# EAGLE design MainBoard (EAGLE 6.4)
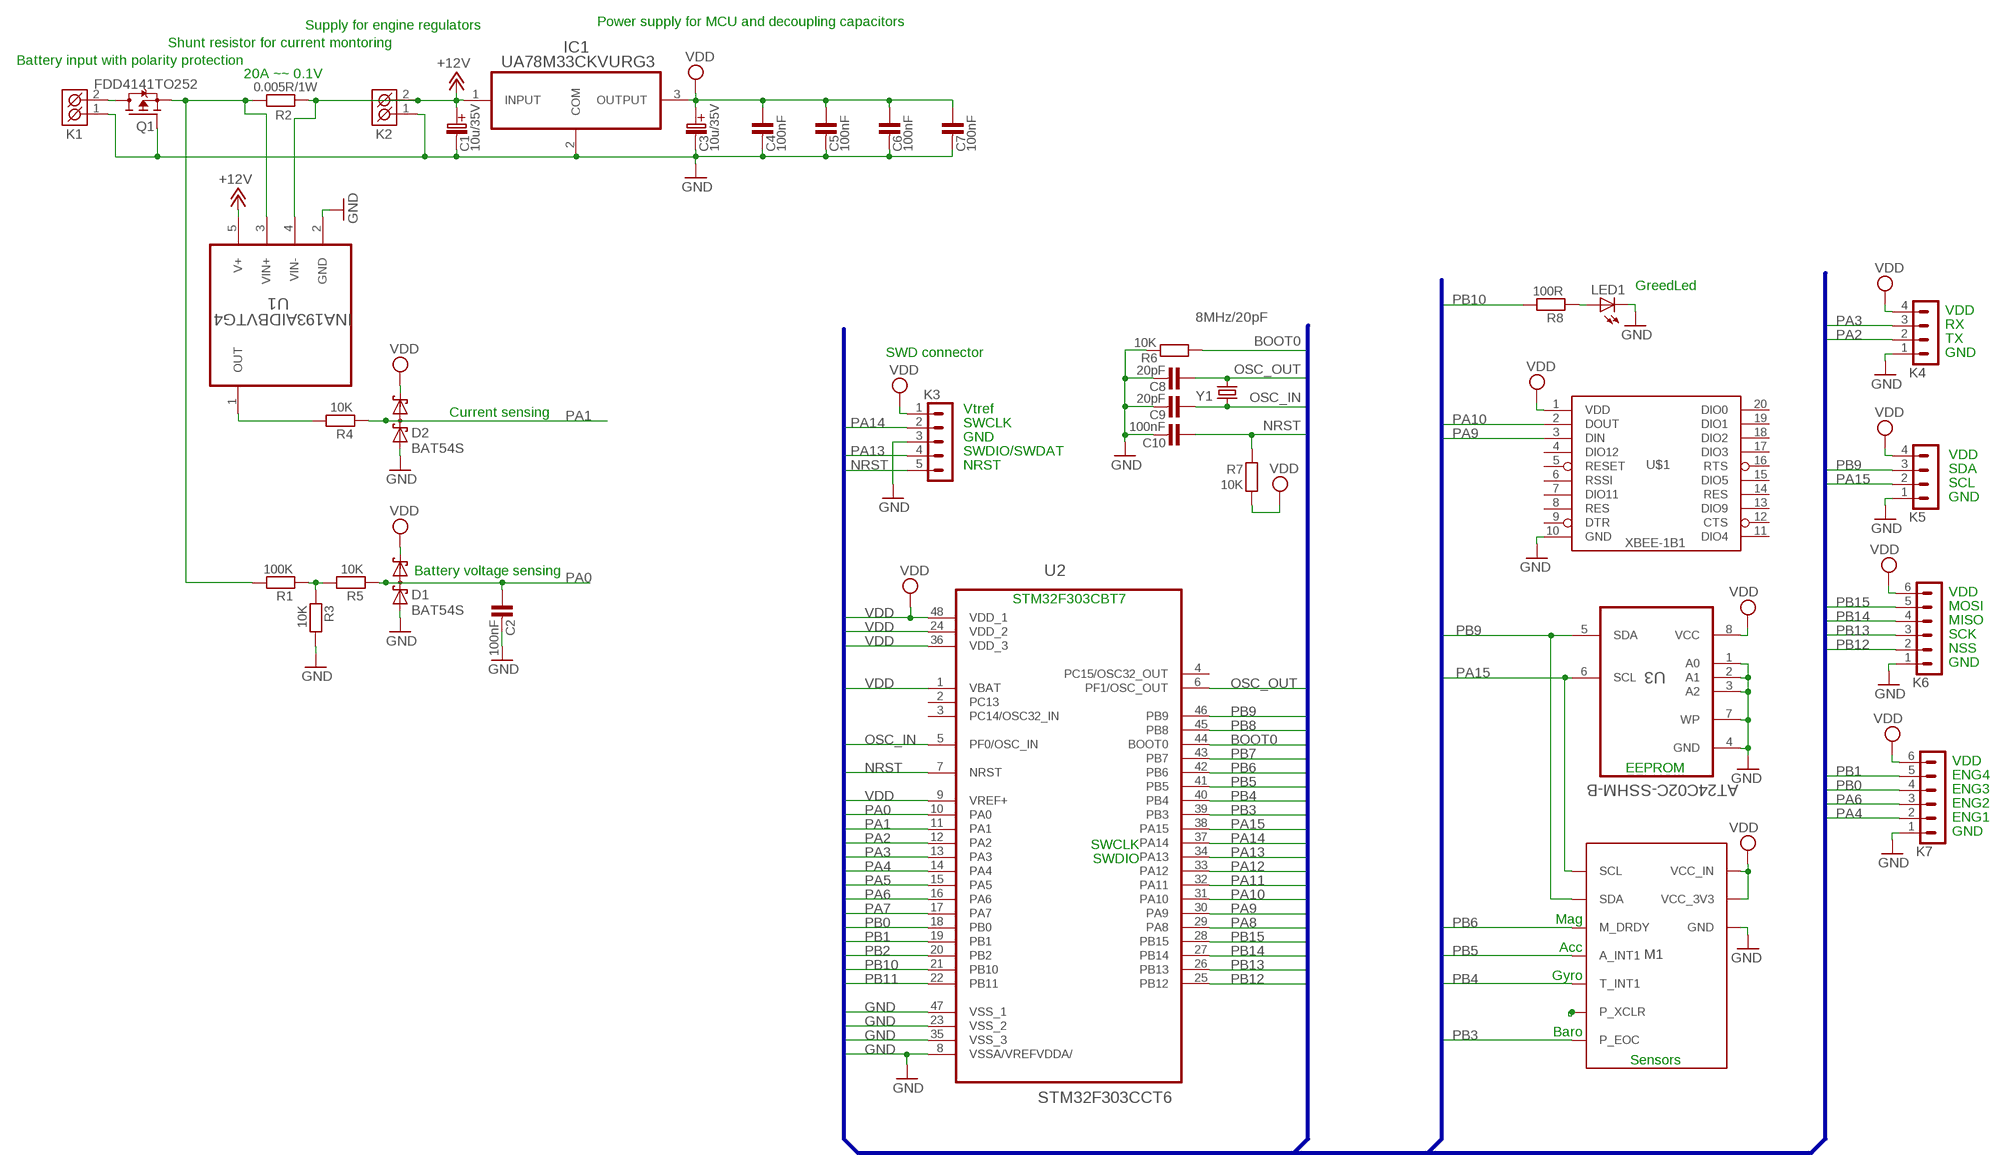
[diagram p0: schematic, sheet 1]

## Parts
C1  10u/35V  C-ELEKTROLYT_2,5  [C-EL_2,5]
C2  100nF  C-KERAMIK_SMD_1206  [1206]
C3  10u/35V  C-ELEKTROLYT_2,5  [C-EL_2,5]
C4  100nF  C-KERAMIK_SMD_1206  [1206]
C5  100nF  C-KERAMIK_SMD_1206  [1206]
C6  100nF  C-KERAMIK_SMD_1206  [1206]
C7  100nF  C-KERAMIK_SMD_1206  [1206]
C8  20pF  C-KERAMIK_SMD_1206  [1206]
C9  20pF  C-KERAMIK_SMD_1206  [1206]
C10  100nF  C-KERAMIK_SMD_1206  [1206]
D1  BAT54S  [SOT23]
D2  BAT54S  [SOT23]
IC1  UA78M33CKVURG3  [TO285P991X230-3N]
K1  ARK500/2  [ARK500/2]
K2  ARK500/2  [ARK500/2]
K3  PSH02-05P  [PSH02-05P]
K4  PSH02-04P  [PSH02-04P]
K5  PSH02-04P  [PSH02-04P]
K6  PSH02-06P  [PSH02-06P]
K7  PSH02-06P  [PSH02-06P]
LED1  LED_E  [LED_1206]
M1  GY-80_DEV  [GY-80_PAC]
Q1  FDD4141TO252  [TO252]
R1  100K  R_SMD_1206  [1206]
R2  0.005R/1W  R_12,7  [R-12,7]
R3  10K  R_SMD_1206  [1206]
R4  10K  R_SMD_1206  [1206]
R5  10K  R_SMD_1206  [1206]
R6  10K  R_SMD_1206  [1206]
R7  10K  R_SMD_1206  [1206]
R8  100R  R_SMD_1206  [1206]
U1  INA193AIDBVTG4  [SOT95P280X145-5N]
U2  STM32F303CCT6  [QFP50P900X900X160-48N]
U3  AT24C02C-SSHM-B  [SOIC127P600X175-8N]
U$1  XBEE-1B1  [XBEE-1]
Y1  8MHz/20pF  CRYSTALSMD  [HC49UP]

## Nets
+12V: C1.C+(C_EL+) IC1.1(INPUT) K2.2(K2) R2.1 U1.4(VIN-) U1.5(V+)
BOOT0: R6.2 U2.44(BOOT0)
GND: C1.C-(C_EL-) C2.2 C3.C-(C_EL-) C4.2 C5.2 C6.2 C7.2 C8.2 C9.2 C10.2 D1.1(A1) D2.1(A1) IC1.2(COM) K1.1(K1) K2.1(K1) K3.3 K4.1 K5.1 K6.1 K7.1 LED1.C M1.GND Q1.1(G) R3.2 R6.1 U1.2(GND) U2.8(VSSA/VREFVDDA/) U2.23(VSS_2) U2.35(VSS_3) U2.47(VSS_1) U3.1(A0) U3.2(A1) U3.3(A2) U3.4(GND) U3.7(WP) U$1.10(GND)
N$1: R4.2 U1.1(OUT)
N$2: M1.P_XCLR
N$3: Q1.2(S) R1.2 R2.2 U1.3(VIN+)
N$4: K1.2(K2) Q1.3(D)
N$9: R1.1 R3.1 R5.2
N$18: LED1.A R8.1
NRST: C10.1 K3.5 R7.2 U2.7(NRST)
OSC_IN: C9.1 U2.5(PF0/OSC_IN) Y1.1
OSC_OUT: C8.1 U2.6(PF1/OSC_OUT) Y1.2
PA0: C2.1 D1.3(C1A2) R5.1 U2.10(PA0)
PA1: D2.3(C1A2) R4.1 U2.11(PA1)
PA2: K4.2 U2.12(PA2)
PA3: K4.3 U2.13(PA3)
PA4: K7.2 U2.14(PA4)
PA5: U2.15(PA5)
PA6: K7.3 U2.16(PA6)
PA7: U2.17(PA7)
PA8: U2.29(PA8)
PA9: U2.30(PA9) U$1.3(DIN)
PA10: U2.31(PA10) U$1.2(DOUT)
PA11: U2.32(PA11)
PA12: U2.33(PA12)
PA13: K3.4 U2.34(PA13)
PA14: K3.2 U2.37(PA14)
PA15: K5.2 M1.SCL U2.38(PA15) U3.6(SCL)
PB0: K7.4 U2.18(PB0)
PB1: K7.5 U2.19(PB1)
PB2: U2.20(PB2)
PB3: M1.P_EOC U2.39(PB3)
PB4: M1.T_INT1 U2.40(PB4)
PB5: M1.A_INT1 U2.41(PB5)
PB6: M1.M_DRDY U2.42(PB6)
PB7: U2.43(PB7)
PB8: U2.45(PB8)
PB9: K5.3 M1.SDA U2.46(PB9) U3.5(SDA)
PB10: R8.2 U2.21(PB10)
PB11: U2.22(PB11)
PB12: K6.2 U2.25(PB12)
PB13: K6.3 U2.26(PB13)
PB14: K6.4 U2.27(PB14)
PB15: K6.5 U2.28(PB15)
VDD: C3.C+(C_EL+) C4.1 C5.1 C6.1 C7.1 D1.2(C2) D2.2(C2) IC1.3(OUTPUT) K3.1 K4.4 K5.4 K6.6 K7.6 M1.VCC_3V3 M1.VCC_IN R7.1 U2.1(VBAT) U2.9(VREF+) U2.24(VDD_2) U2.36(VDD_3) U2.48(VDD_1) U3.8(VCC) U$1.1(VDD)
Unconnected: U2.2(PC13) U2.3(PC14/OSC32_IN) U2.4(PC15/OSC32_OUT) U$1.4(DIO12) U$1.5(RESET) U$1.6(RSSI) U$1.7(DIO11) U$1.8(RES) U$1.9(DTR) U$1.11(DIO4) U$1.12(CTS) U$1.13(DIO9) U$1.14(RES) U$1.15(DIO5) U$1.16(RTS) U$1.17(DIO3) U$1.18(DIO2) U$1.19(DIO1) U$1.20(DIO0)

## Buses
BOOT0,NRST,OSC_IN,OSC_OUT,OSC32_IN,OSC32_OUT,VDD,VBAT,GND,VREF,PA[0..15],PB[0..15]

## Notes on the sheet
- Supply for engine regulators | Power supply for MCU and decoupling capacitors
- Shunt resistor for current montoring
- Battery input with polarity protection | 20A ~~ 0.1V
- GreedLed
- VDD
- RX
- TX
- SWD connector | GND
- Current sensing | Vtref
- SWCLK
- GND
- SWDIO/SWDAT | VDD
- NRST | SDA
- SCL
- GND
- Battery voltage sensing
- VDD
- STM32F303CBT7
- MOSI
- MISO
- SCK
- NSS
- GND
- VDD
- EEPROM
- ENG4
- ENG3
- ENG2
- ENG1
- SWCLK | GND
- SWDIO
- Mag
- Acc
- Gyro
- Baro
- Sensors

## Library data of the parts
C1 C3 = #PaJa_30:C-ELEKTROLYT: Kondenzator - elektrolyticky
C2 C4-C10 = #PaJa_30:C-KERAMIK: Kondenzator - keramicky
D1 D2 = diode:BAT54S: Schottky Diodes Pin connection corrected 2011-05-04 Source: Fairchild .. BAT54.pdf
IC1 = !moje_Sobriety:UA78M33CKVURG3: IC, POSITIVE-VOLTAGE REGULATORS, 3.3V, 3-TO-252; MPN: UA78M33CKVURG3; OC_FARNELL: 2075446; OC_NEWARK: 80K3502; PACKAGE: 3-TO-252; SUPPLIER: TEXAS INSTRUMENTS
K1 K2 = #PaJa_konektory:ARK500/2: Svorkovnice - roztec 5mm - dvojita
K3 = #PaJa_konektory:PSH02-05: Konektory se zamkem - vidlice - 5pin
K4 K5 = #PaJa_konektory:PSH02-04: Konektory se zamkem - vidlice - 4pin
K6 K7 = #PaJa_konektory:PSH02-06: Konektory se zamkem - vidlice - 6pin
LED1 = eagle-ltspice:LED_E: LED Source: http://www.osram.convergy.de Source: www.luxeon.com Source: www.kingbright.com; SPICEMODEL: NONE; SPICEPREFIX: D; SPICETYPE: diode
M1 = !moje_Sobriety:GY-80_DEV
Q1 = transistor-fet:FDD4141: P-Channel PowerTrench® MOSFET Source: FDD4141.pdf
R1-R8 = #PaJa_30:R: Rezistor
U1 = !moje_Sobriety:INA193AIDBVTG4: CURRENT SHUNT MONITOR -16V to +80V Common-Mode Range; MPN: INA193AIDBVTG4; OC_FARNELL: 1703229; OC_NEWARK: 37K0156; PACKAGE: SOT-23-5; SUPPLIER: Texas Instruments
U2 = !moje_Sobriety:STM32F303CCT6: MCU, 32BIT, CORTEX M4, 48LQFP; MPN: STM32F303CCT6; OC_FARNELL: 2215113; OC_NEWARK: 46W2192; PACKAGE: 48LQFP; SUPPLIER: STMicroelectronics
U3 = !moje_Sobriety:AT24C02C-SSHM-B: SERIAL EEPROM IC Memory Size:2Kbit,8-SOIC; MPN: AT24C02C-SSHM-B; OC_FARNELL: 1971995; OC_NEWARK: 68T4066; PACKAGE: 8SOIC; SUPPLIER: ATMEL
U$1 = SparkFun:XBEE-1
Y1 = SparkFun:CRYSTAL: Crystals Various standard crystals. Proven footprints. Spark Fun Electronics SKU : COM-00534

## Board
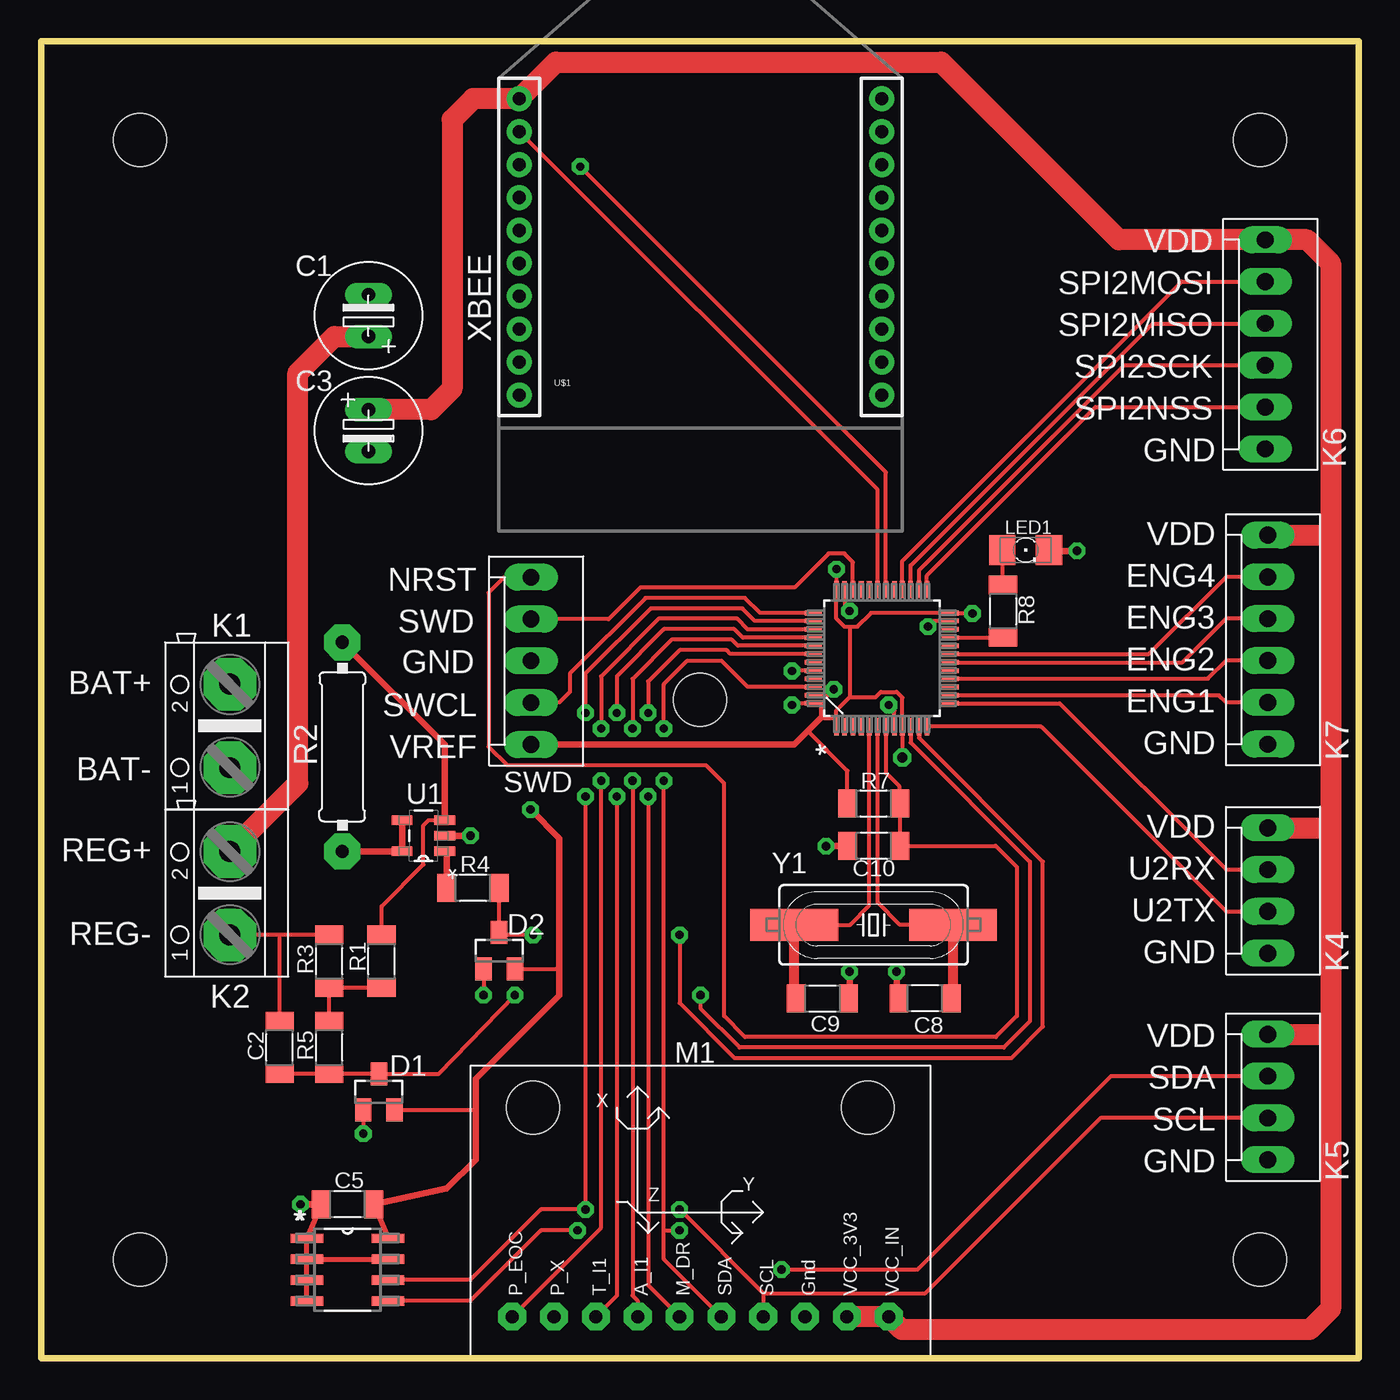
[diagram p1: board, top side]
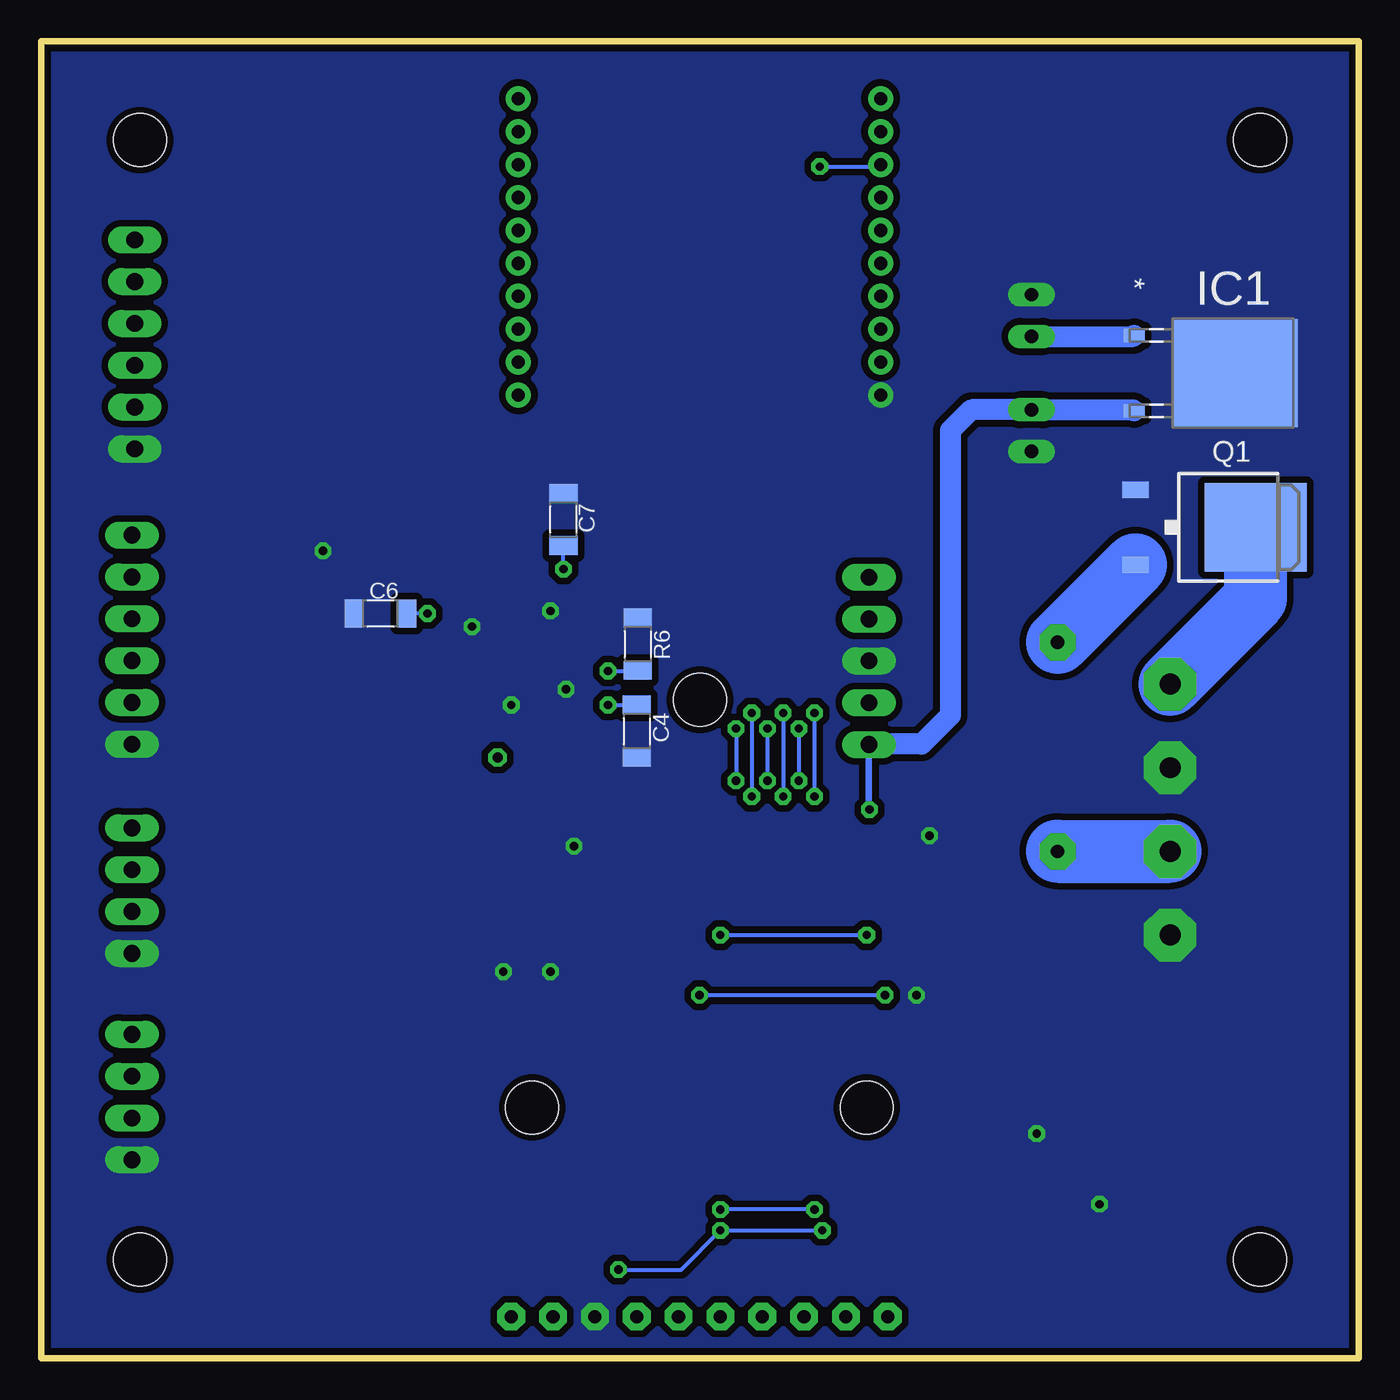
[diagram p2: board, bottom side, seen from below]

Size 80 x 80 mm. Coordinates in mm from the lower left corner, seen from the top.
Outline: 0,80 0,0 80,0 80,80 0,80
Copper layers (1*16): Top 0.035mm / dielectric 1.5mm / Bottom 0.035mm
Design rules "SparkFun": minimum track width 8mil, minimum drill 20mil, track to track 8mil, track to pad 8mil, pad to pad 8mil, via to via 8mil, smd to smd 8mil, copper to edge 10mil, drill to drill 8mil, minimum pad ring 12mil, minimum via ring 10mil, stop-mask expansion 4mil, vias tented up to drill 25mil, thermal gap 10mil
Holes 3.2 mm at 6,6 74,6 74,74 6,74 40,40

### Footprints (pad centres in the part's own frame; a part is rotated, then mirrored left to right if it is on the bottom)
C-EL_2,5 = drill 0.813 pad 1.27 long: C+ -1.27,0; C- 1.27,0
1206 = smd 1.143 x 1.702: 1 -1.587,0; 2 1.587,0
SOT23 = smd 1 x 1.4: 1 -0.95,-1.1; 2 0.95,-1.1; 3 0,1.1
TO285P991X230-3N = smd 0.813 x 1.27: 1 -2.286,-5.994; 3 2.286,-5.994 | smd 6.579 x 7.595: 2 0,0.152
ARK500/2 = drill 1.27 pad 3.2 octagon: 1 -2.54,0; 2 2.54,0
PSH02-05P = drill 1.016 pad 1.422 long: 1 -5.08,0; 2 -2.54,0; 3 0,0; 4 2.54,0; 5 5.08,0
PSH02-04P = drill 1.016 pad 1.422 long: 1 -3.81,0; 2 -1.27,0; 3 1.27,0; 4 3.81,0
PSH02-06P = drill 1.016 pad 1.422 long: 1 -6.35,0; 2 -3.81,0; 3 -1.27,0; 4 1.27,0; 5 3.81,0; 6 6.35,0
LED_1206 = smd 1.6 x 1.803: A -1.422,0; C 1.422,0
GY-80_PAC = drill 0.8 pad 1.676 octagon: A_INT1 -7.62,-5.08; GND 2.54,-5.08; M_DRDY -5.08,-5.08; P_EOC -15.24,-5.08; P_XCLR -12.7,-5.08; SCL 0,-5.08; SDA -2.54,-5.08; T_INT1 -10.16,-5.08; VCC_3V3 5.08,-5.08; VCC_IN 7.62,-5.08 | hole 3.2: -13.97,7.62; 6.35,7.62
TO252 = smd 1 x 1.6: 1 -2.28,-4.8; 2 2.28,-4.8 | smd 5.4 x 6.2: 3 0,2.5
R-12,7 = drill 0.813 pad 2.184 octagon: 1 -6.35,0; 2 6.35,0
SOT95P280X145-5N = smd 1.27 x 0.559: 1 -1.295,0.94; 2 -1.295,0; 3 -1.295,-0.94; 4 1.295,-0.94; 5 1.295,0.94
QFP50P900X900X160-48N = smd 1.041 x 0.279: 1 -4.166,2.743; 2 -4.166,2.261; 3 -4.166,1.753; 4 -4.166,1.245; 5 -4.166,0.762; 6 -4.166,0.254; 7 -4.166,-0.254; 8 -4.166,-0.762; 9 -4.166,-1.245; 10 -4.166,-1.753; 11 -4.166,-2.261; 12 -4.166,-2.743; 25 4.166,-2.743; 26 4.166,-2.261; 27 4.166,-1.753; 28 4.166,-1.245; 29 4.166,-0.762; 30 4.166,-0.254; 31 4.166,0.254; 32 4.166,0.762; 33 4.166,1.245; 34 4.166,1.753; 35 4.166,2.261; 36 4.166,2.743 | smd 0.279 x 1.041: 13 -2.743,-4.166; 14 -2.261,-4.166; 15 -1.753,-4.166; 16 -1.245,-4.166; 17 -0.762,-4.166; 18 -0.254,-4.166; 19 0.254,-4.166; 20 0.762,-4.166; 21 1.245,-4.166; 22 1.753,-4.166; 23 2.261,-4.166; 24 2.743,-4.166; 37 2.743,4.166; 38 2.261,4.166; 39 1.753,4.166; 40 1.245,4.166; 41 0.762,4.166; 42 0.254,4.166; 43 -0.254,4.166; 44 -0.762,4.166; 45 -1.245,4.166; 46 -1.753,4.166; 47 -2.261,4.166; 48 -2.743,4.166
SOIC127P600X175-8N = smd 1.981 x 0.559: 1 -2.464,1.905; 2 -2.464,0.635; 3 -2.464,-0.635; 4 -2.464,-1.905; 5 2.464,-1.905; 6 2.464,-0.635; 7 2.464,0.635; 8 2.464,1.905
XBEE-1 = drill 0.8 pad 1.524: 1 -11,20; 2 -11,18; 3 -11,16; 4 -11,14; 5 -11,12; 6 -11,10; 7 -11,8; 8 -11,6; 9 -11,4; 10 -11,2; 11 11,2; 12 11,4; 13 11,6; 14 11,8; 15 11,10; 16 11,12; 17 11,14; 18 11,16; 19 11,18; 20 11,20
HC49UP = smd 5.334 x 1.93: 1 -4.826,0; 2 4.826,0

### Placement (x,y rotation side)
C1  19.87,63.34 90 top
C2  14.47,18.89 90 top
C3  19.87,56.35 270 top
C4  43.84,38.09 270 bottom
C5  18.6,9.36 180 top
C6  59.4,45.24 180 bottom
C7  48.29,50.95 90 bottom
C8  53.67,21.87 180 top
C9  47.43,21.85 0 top
C10  50.56,31.12 180 top
D1  20.5,16.19 0 top
D2  27.81,24.76 0 top
IC1  7.65,59.84 270 bottom
K1  11.46,38.41 90 top
K2  11.46,28.25 90 top
K3  29.74,42.36 90 top
K4  74.48,28.41 90 top
K5  74.48,15.87 90 top
K6  74.32,61.59 90 top
K7  74.48,43.65 90 top
LED1  59.78,49.09 0 top
M1  43.84,7.61 0 top
Q1  8.76,50.48 270 bottom
R1  20.66,24.12 90 top
R2  18.28,37.14 90 top
R3  17.49,24.12 90 top
R4  26.22,28.57 180 top
R5  17.49,18.89 90 top
R6  43.78,43.38 270 bottom
R7  50.54,33.71 0 top
R8  58.4,45.38 270 top
U1  23.2,31.74 180 top
U2  51.04,42.53 90 top
U3  18.6,5.39 0 top
U$1  40.03,56.51 0 top
Y1  50.54,26.33 0 top

### Tracks (layer width: path | path; a pad name or v marks a point on that pad's centre or on a via)
+12V
  Top 0.406: U1.4 U1.5 21.9,30.79 R2.1
  Top 1.27: K2.2 15.58,34.92 15.58,59.84 17.81,62.06 C1.C+
  Bottom 1.27: C1.C+ 13.7,62.06 IC1.1
  Bottom 3.81: R2.1 K2.2
BOOT0  (via drill 0.5 pad 0.41)
  Top 0.254: U2.44 45.61,41.77 v45.59,41.74
  Bottom 0.254: v45.59,41.74 43.67,41.74 R6.2
GND  (via drill 0.5, 0.5 pad 0.41)
  Top 0.254: 51.81,38.37 U2.8 51.8,39.34 v51.46,39.68 | U2.35 48.79,46.68 48.79,45.68 v49.08,45.4 | U2.47 47.76,40.27 v48.13,40.63 | U2.23 54.19,44.79 v53.84,44.44 | D2.1 26.86,21.9 v26.86,22.06 | D1.1 v19.56,13.65 v19.55,13.65 | R3.2 14.47,25.71 | 14.47,25.71 K2.1 | C2.2 14.47,25.71
  Top 0.305: U3.4 U3.3 U3.2 | U3.2 U3.1 C5.2 | U3.2 U3.7
  Top 0.406: C5.2 v15.74,9.36 | C8.2 arc-90 51.94,22.01 v51.94,23.49 | C9.2 arc90 49.08,21.92 v49.08,23.49 | C10.2 arc-90 48.95,31.11 v47.65,31.11 | LED1.C 61.25,49.05 v62.89,49.05 | U1.2 v26.06,31.74
  Bottom 0.254: v26.86,22.06 26.86,21.74 | v19.55,13.65 19.55,13.33
  Bottom 0.406: v51.94,23.49 51.94,23.65 | v49.08,23.49 49.08,23.65 | v62.89,49.05 63.05,49.05 | v26.06,31.74 25.9,31.74
  pour Bottom (isolate 0.406, no thermals): 0.03,80 80.04,80 80.04,-0.01 0.03,-0.01
N$1
  Top 0.406: R4.2 24.63,30.67 U1.1
N$3
  Top 0.254: R1.2 20.66,27.46 23.2,30 23.2,32.38 23.52,32.7 24.49,32.7 U1.3
  Top 0.406: U1.3 24.5,37.27 R2.2
  Bottom 3.81: Q1.2 18.26,43.49 R2.2
N$4
  Bottom 3.81: K1.2 6.26,46.15 Q1.3
N$9
  Top 0.254: R1.1 R3.1 R5.2
N$18
  Top 0.254: 58.4,46.87 R8.1 58.4,49.05 LED1.A
NRST
  Top 0.254: U2.7 51.3,38.35 51.3,35.55 52.13,34.73 R7.2 52.13,31.14 C10.1 57.95,31.12 59.24,29.84 59.24,20.79 57.97,19.52 42.73,19.52 41.46,20.79 41.46,34.92 40.35,36.03 28.28,36.03 27.17,37.14 27.17,46.51 28.13,47.46 29.73,47.46 K3.5
OSC_IN
  Top 0.254: C9.1 arc-90 45.71,21.71 | Y1.1 49.11,26.33 50.28,27.49 U2.5
  Top 0.61: 45.71,21.71 Y1.1
OSC_OUT
  Top 0.254: C8.1 arc-90 55.37,21.66 | U2.6 50.79,27.68 52.13,26.33 Y1.2
  Top 0.61: 55.37,21.66 Y1.2
PA0  (via drill 0.5, 0.5 pad 0.41)
  Top 0.254: U2.10 52.79,37.4 60.03,30.16 60.03,20.47 58.45,18.88 42.41,18.88 40.03,21.27 v40.03,22.06 | C2.1 R5.1 D1.3 24.15,17.29 v28.76,22.06
  Bottom 0.254: v28.76,22.06 v40.03,22.06
PA1  (via drill 0.5, 0.5 pad 0.41)
  Top 0.254: U2.11 53.3,37.68 60.83,30.16 60.83,20.15 58.92,18.25 42.1,18.25 38.76,21.58 v38.76,25.71 | 27.8,28.56 R4.1 D2.3 27.96,25.71 v29.87,25.71
  Bottom 0.254: v38.76,25.71 v29.87,25.71
PA2
  Top 0.254: U2.12 60.72,38.36 71.94,27.14 K4.2
PA3
  Top 0.254: U2.13 61.83,39.79 71.94,29.68 K4.3
PA4
  Top 0.254: K7.2 71.94,39.84 71.51,40.27 U2.14
PA6
  Top 0.254: U2.16 70.84,41.28 71.94,42.38 K7.3
PA9  (via drill 0.5 pad 0.41)
  Top 0.254: U2.30 51.29,53.82 v32.73,72.38
  Bottom 0.254: v32.73,72.38 29.16,72.38 U$1.3
PA10
  Top 0.254: U2.31 50.79,52.75 U$1.2
PA13
  Top 0.254: K3.4 30.82,44.9 31.3,44.9 34.46,44.9 36.38,46.82 45.75,46.82 47.81,48.89 48.76,48.89 49.29,48.36 U2.34
PA14
  Top 0.254: K3.2 29.76,39.84 31.46,39.84 32.09,40.47 32.09,41.59 36.7,46.19 42.73,46.19 43.65,45.27 U2.37
PA15  (via drill 0.5 pad 0.41)
  Top 0.254: U2.38 43.34,44.79 42.57,45.55 37.02,45.55 33.05,41.59 v33.05,39.2 | v33.05,34.12 v33.05,9.04 30.35,9.04 26.06,4.76 U3.6 | K5.2 64.32,14.6 53.68,3.96 43.84,3.96 | v38.76,9.04 43.84,3.96 | 43.84,3.96 M1.SCL
  Bottom 0.254: v33.05,39.2 v33.05,34.12 | v33.05,9.04 v38.76,9.04
PB0
  Top 0.254: U2.18 69.3,42.27 71.94,44.92 K7.4
PB1
  Top 0.254: U2.19 67.26,42.78 71.94,47.46 K7.5
PB3  (via drill 0.5 pad 0.41)
  Top 0.254: U2.39 42.89,44.28 42.25,44.92 37.49,44.92 34,41.43 v34,38.25 | M1.P_EOC 34,7.93 v34,35.08
  Bottom 0.254: v34,38.25 v34,35.08
PB4  (via drill 0.5 pad 0.41)
  Top 0.254: U2.40 42.61,43.77 42.1,44.28 37.81,44.28 34.95,41.43 v34.95,39.2 | v34.95,34.12 34.95,3.8 M1.T_INT1
  Bottom 0.254: v34.95,39.2 v34.95,34.12
PB5  (via drill 0.5 pad 0.41)
  Top 0.254: U2.41 42.3,43.29 41.94,43.65 38.29,43.65 35.9,41.27 v35.9,38.25 | v35.9,35.08 35.9,3.8 36.22,3.49 M1.A_INT1
  Bottom 0.254: v35.9,38.25 v35.9,35.08
PB6  (via drill 0.5 pad 0.41)
  Top 0.254: U2.42 41.85,42.78 41.62,43.01 38.76,43.01 36.86,41.11 v36.86,39.2 | v36.86,34.12 36.86,4.44 M1.M_DRDY
  Bottom 0.254: v36.86,39.2 v36.86,34.12
PB9  (via drill 0.5 pad 0.41)
  Top 0.254: U2.46 42.91,40.78 41.3,42.38 39.24,42.38 37.81,40.95 v37.81,38.25 | M1.SDA 37.81,6.03 37.81,7.77 | 37.81,7.77 v37.81,35.08 | 37.81,7.77 v38.76,7.77 | v32.57,7.77 30.35,7.77 26.06,3.49 U3.5 | K5.3 64.96,17.14 53.21,5.39 v44.95,5.39
  Bottom 0.254: v37.81,38.25 v37.81,35.08 | v32.57,7.77 v38.76,7.77 41.14,5.39 v44.95,5.39
PB10
  Top 0.254: U2.21 55.22,43.79 R8.2
PB12
  Top 0.254: U2.25 53.78,47.56 64,57.78 K6.2
PB13
  Top 0.254: U2.26 53.3,47.87 65.75,60.32 K6.3
PB14
  Top 0.254: U2.27 52.79,48.16 67.5,62.86 K6.4
PB15
  Top 0.254: U2.28 52.28,48.44 69.24,65.4 K6.5
VDD  (via drill 0.5 pad 0.41, 0.6 pad 0.81)
  Top 0.254: v52.29,36.49 v52.28,36.49 U2.9 52.28,40.13 51.94,40.47 50.99,40.47 50.67,40.16 49.08,40.16 | v56.54,45.24 56.51,45.27 U2.24 50.38,45.27 49.56,44.44 49.08,44.44 | v48.29,47.94 48.3,47.93 U2.36 48.3,46.04 48.29,46.03 48.29,44.92 48.76,44.44 49.08,44.44 | v45.59,39.68 45.69,39.79 U2.48 47.33,39.79 47.33,38.89 48.29,38.89 | 48.29,38.89 48.29,38.37 U2.1 | 49.08,44.44 49.08,40.16 | 49.08,40.16 48.29,39.36 48.29,38.89 | R7.1 48.95,35.68 46.54,38.09 | D1.2 26.21,15.09 26.38,14.92 | D2.2 31.29,23.66 31.46,23.49
  Top 0.305: C5.1 U3.8
  Top 0.406: K3.1 45.73,37.28 46.54,38.09 47.33,38.89 | v29.71,33.33 31.46,31.58 31.46,23.49 31.46,22.06 26.38,16.98 26.38,14.92 26.38,12.06 24.63,10.31 C5.1
  Top 1.27: 78.29,50 78.29,66.51 76.86,67.94 K6.6 65.43,67.94 54.64,78.73 31.26,78.73 U$1.1 26.22,76.51 24.95,75.24 24.95,58.89 23.68,57.62 C3.C+ | 78.29,50 78.29,32.22 | 78.29,32.22 78.29,19.52 | 78.29,19.52 78.29,3.01 77.02,1.74 52.26,1.74 M1.VCC_IN M1.VCC_3V3 | K7.6 78.29,50 | K4.4 78.29,32.22 | K5.4 78.13,19.68 78.29,19.52
  Bottom 0.254: v56.54,45.24 C6.1 | v48.29,47.94 C7.1 | v45.59,39.68 C4.1
  Bottom 0.406: K3.1 29.74,33.33 v29.71,33.33
  Bottom 1.27: IC1.3 13.7,57.62 C3.C+ 23.52,57.62 24.79,56.35 24.79,39.05 26.54,37.3 29.73,37.3 K3.1

### Text on the board
tNames: VDD | SPI2MOSI | SPI2MISO | XBEE | SPI2SCK | SPI2NSS | GND | VDD | NRST | ENG4 | SWD | ENG3 | GND | ENG2 | BAT+ | SWCL | ENG1 | VREF | GND | BAT- | SWD | VDD | REG+ | U2RX | U2TX | REG- | GND | VDD | SDA | SCL | GND